# EAGLE schematic PropVGA (EAGLE 6.4)
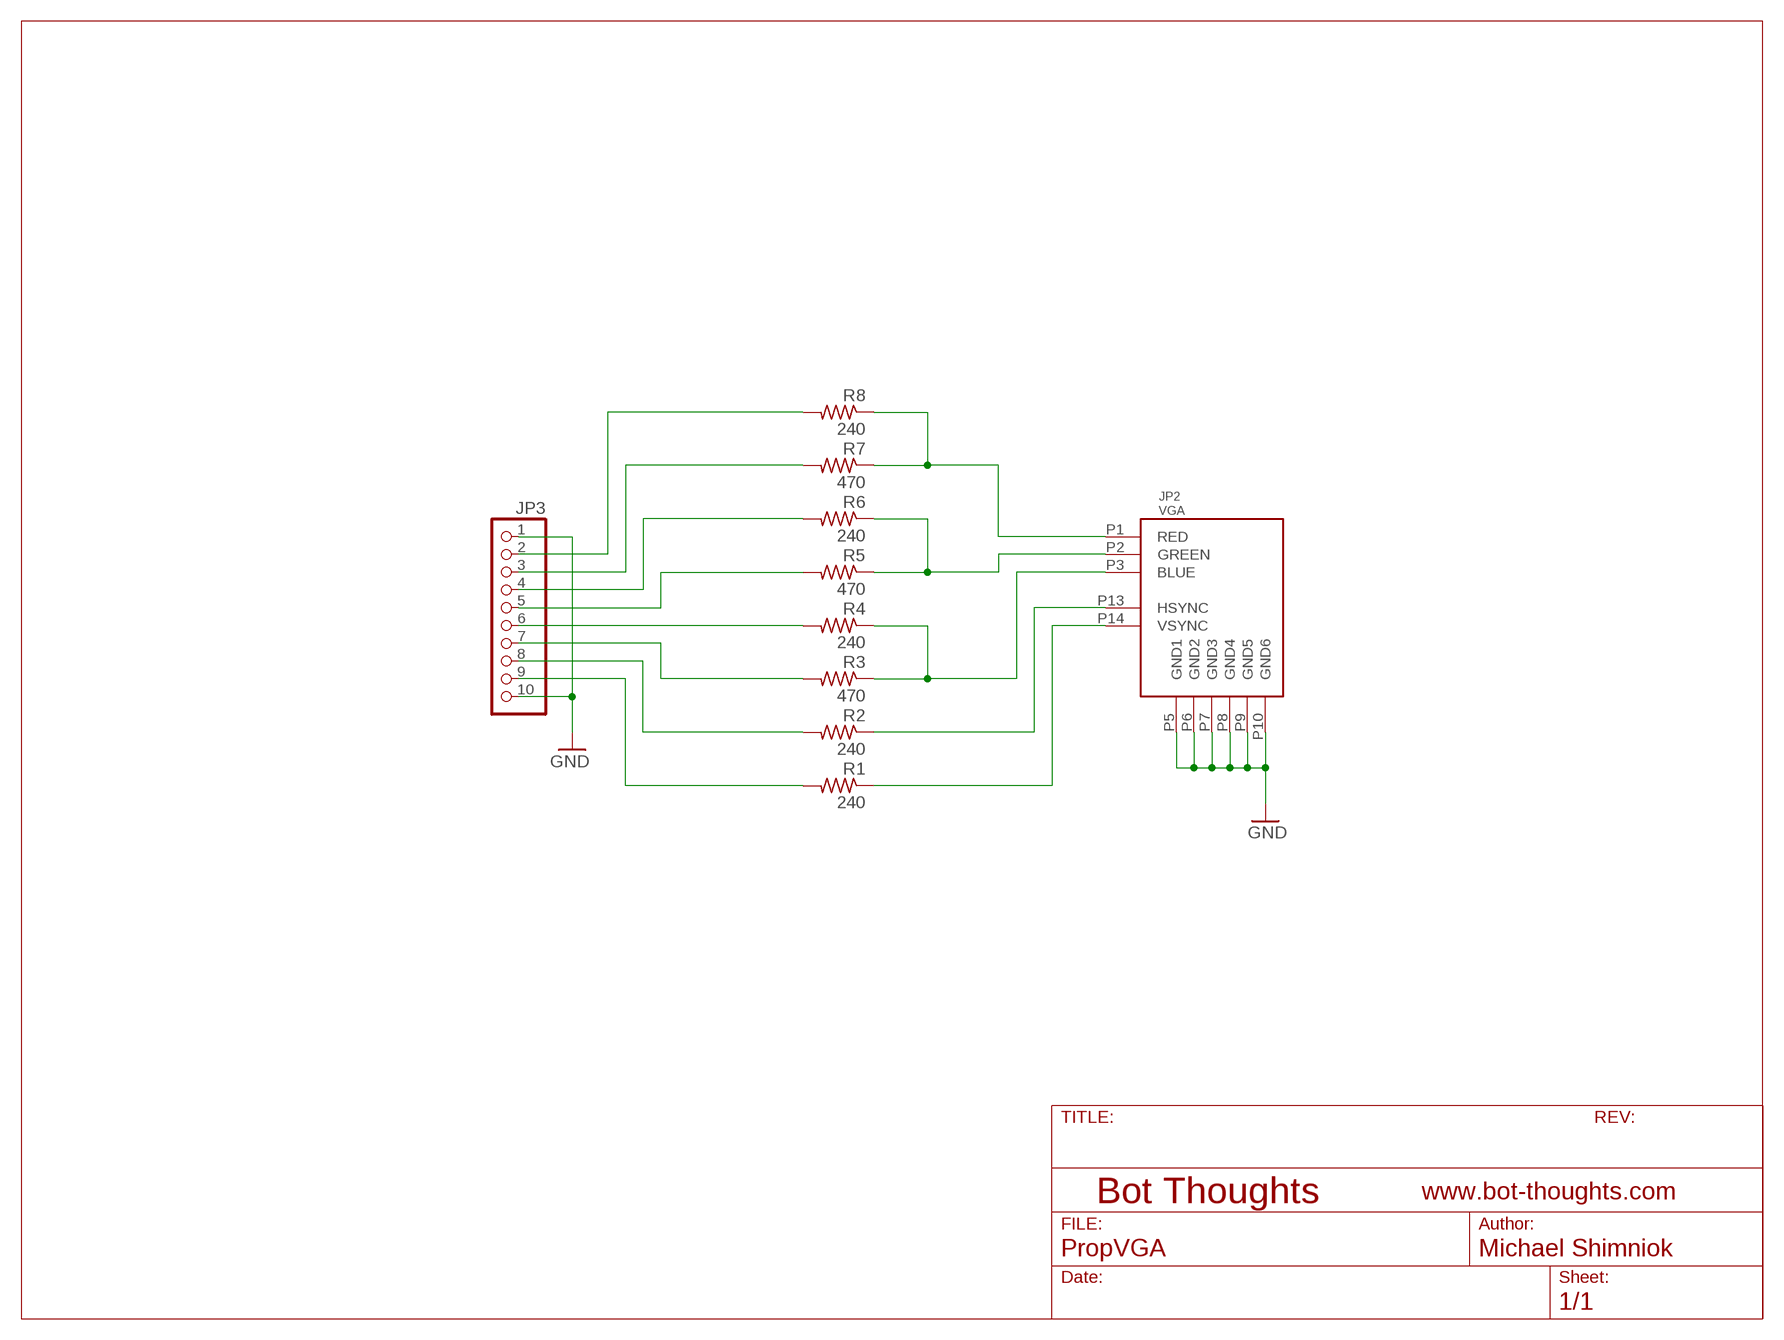
[diagram p0: schematic, sheet 1]

## Parts
JP2  VGA  [FCI_DSUB_HD_15_RA]
JP3  PINHD-1X10_2.54-S  [1X10-S]
R1  240  R-US_0204/5  [0204/5]
R2  240  R-US_0204/5  [0204/5]
R3  470  R-US_0204/5  [0204/5]
R4  240  R-US_0204/5  [0204/5]
R5  470  R-US_0204/5  [0204/5]
R6  240  R-US_0204/5  [0204/5]
R7  470  R-US_0204/5  [0204/5]
R8  240  R-US_0204/5  [0204/5]

## Nets
B: JP2.P3(BLUE) R3.1 R4.1
G: JP2.P2(GREEN) R5.1 R6.1
GND: JP2.P5(GND1) JP2.P6(GND2) JP2.P7(GND3) JP2.P8(GND4) JP2.P9(GND5) JP2.P10(GND6) JP3.1 JP3.10
H: JP2.P13(HSYNC) R2.1
N$12: JP3.9 R1.2
N$13: JP3.8 R2.2
N$14: JP3.7 R3.2
N$15: JP3.6 R4.2
N$16: JP3.5 R5.2
N$17: JP3.4 R6.2
N$18: JP3.3 R7.2
N$19: JP3.2 R8.2
R: JP2.P1(RED) R7.1 R8.1
V: JP2.P14(VSYNC) R1.1

## Library data of the parts
JP2 = mes_electromech:VGA: VGA Connector
JP3 = pinhead-2:PINHD-1X10: PIN HEADER
R1-R8 = rcl:R-US_: RESISTOR, American symbol